# Vivado block design msys, xc7a100tfgg484-2, Vivado 2020.2.2
# (continued, part 2 of 3)
current_bd_instance /SCOPE

# ---- hierarchy /CFG_Si5338 ----
current_bd_instance /CFG_Si5338
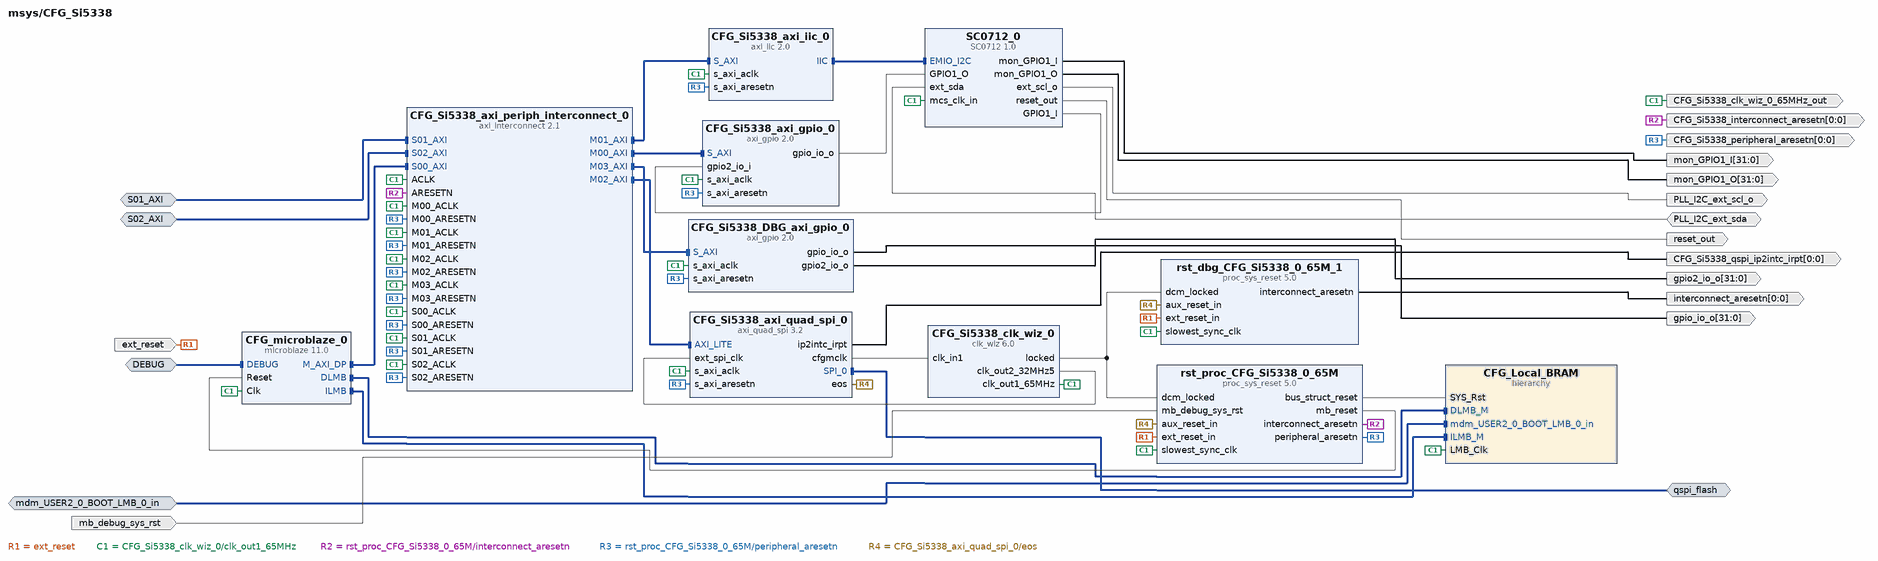
[diagram p17: block diagram inside /CFG_Si5338]
create_bd_intf_pin -mode Master -vlnv xilinx.com:interface:spi_rtl:1.0 qspi_flash
create_bd_intf_pin -mode Slave -vlnv xilinx.com:interface:aximm_rtl:1.0 S02_AXI
create_bd_intf_pin -mode Slave -vlnv xilinx.com:interface:lmb_rtl:1.0 mdm_USER2_0_BOOT_LMB_0_in
create_bd_intf_pin -mode Slave -vlnv xilinx.com:interface:aximm_rtl:1.0 S01_AXI
create_bd_intf_pin -mode Slave -vlnv xilinx.com:interface:mbdebug_rtl:3.0 DEBUG
create_bd_pin -dir O -from 0 -to 0 -type intr CFG_Si5338_qspi_ip2intc_irpt
create_bd_pin -dir O -from 31 -to 0 mon_GPIO1_I
create_bd_pin -dir O -from 31 -to 0 mon_GPIO1_O
create_bd_pin -dir O PLL_I2C_ext_scl_o
create_bd_pin -dir IO PLL_I2C_ext_sda
create_bd_pin -dir O -type rst reset_out
create_bd_pin -dir I -type rst ext_reset
create_bd_pin -dir O -from 0 -to 0 -type rst CFG_Si5338_interconnect_aresetn
create_bd_pin -dir I -type rst mb_debug_sys_rst
create_bd_pin -dir O -from 0 -to 0 -type rst CFG_Si5338_peripheral_aresetn
create_bd_pin -dir O -type clk CFG_Si5338_clk_wiz_0_65MHz_out
create_bd_pin -dir O -from 0 -to 0 -type rst interconnect_aresetn
create_bd_pin -dir O -from 31 -to 0 gpio_io_o
create_bd_pin -dir O -from 31 -to 0 gpio2_io_o

create_bd_cell -type ip -vlnv trenz.biz:user:SC0712:1.0 SC0712_0
create_bd_cell -type ip -vlnv xilinx.com:ip:proc_sys_reset:5.0 rst_proc_CFG_Si5338_0_65M
set_property -dict [list \
  CONFIG.C_AUX_RESET_HIGH 0 \
  CONFIG.C_NUM_PERP_RST 1 \
  CONFIG.RESET_BOARD_INTERFACE reset \
  CONFIG.USE_BOARD_FLOW true \
] [get_bd_cells rst_proc_CFG_Si5338_0_65M]
create_bd_cell -type hier CFG_Local_BRAM
create_bd_cell -type ip -vlnv xilinx.com:ip:proc_sys_reset:5.0 rst_dbg_CFG_Si5338_0_65M_1
set_property -dict [list \
  CONFIG.C_AUX_RESET_HIGH 0 \
  CONFIG.C_NUM_PERP_RST 1 \
  CONFIG.RESET_BOARD_INTERFACE reset \
  CONFIG.USE_BOARD_FLOW true \
] [get_bd_cells rst_dbg_CFG_Si5338_0_65M_1]
create_bd_cell -type ip -vlnv xilinx.com:ip:axi_gpio:2.0 CFG_Si5338_DBG_axi_gpio_0
set_property -dict [list \
  CONFIG.C_ALL_INPUTS 0 \
  CONFIG.C_ALL_INPUTS_2 0 \
  CONFIG.C_ALL_OUTPUTS 1 \
  CONFIG.C_ALL_OUTPUTS_2 1 \
  CONFIG.C_DOUT_DEFAULT 0x00000003 \
  CONFIG.C_IS_DUAL 1 \
] [get_bd_cells CFG_Si5338_DBG_axi_gpio_0]
create_bd_cell -type ip -vlnv xilinx.com:ip:axi_gpio:2.0 CFG_Si5338_axi_gpio_0
set_property -dict [list \
  CONFIG.C_ALL_INPUTS_2 1 \
  CONFIG.C_ALL_OUTPUTS 1 \
  CONFIG.C_DOUT_DEFAULT 0x00000003 \
  CONFIG.C_IS_DUAL 1 \
] [get_bd_cells CFG_Si5338_axi_gpio_0]
create_bd_cell -type ip -vlnv xilinx.com:ip:axi_iic:2.0 CFG_Si5338_axi_iic_0
set_property -dict {CONFIG.IIC_FREQ_KHZ 100} [get_bd_cells CFG_Si5338_axi_iic_0]
create_bd_cell -type ip -vlnv xilinx.com:ip:axi_interconnect:2.1 CFG_Si5338_axi_periph_interconnect_0
set_property -dict {CONFIG.NUM_MI 4 CONFIG.NUM_SI 3} [get_bd_cells CFG_Si5338_axi_periph_interconnect_0]
create_bd_cell -type ip -vlnv xilinx.com:ip:axi_quad_spi:3.2 CFG_Si5338_axi_quad_spi_0
set_property -dict [list \
  CONFIG.C_FIFO_DEPTH 256 \
  CONFIG.C_SPI_MEMORY 3 \
  CONFIG.C_SPI_MODE 2 \
  CONFIG.C_S_AXI4_ID_WIDTH 0 \
  CONFIG.QSPI_BOARD_INTERFACE qspi_flash \
  CONFIG.USE_BOARD_FLOW true \
] [get_bd_cells CFG_Si5338_axi_quad_spi_0]
create_bd_cell -type ip -vlnv xilinx.com:ip:clk_wiz:6.0 CFG_Si5338_clk_wiz_0
set_property -dict [list \
  CONFIG.CLKIN1_JITTER_PS 153.84 \
  CONFIG.CLKIN2_JITTER_PS 162.49 \
  CONFIG.CLKOUT1_DRIVES BUFGCE \
  CONFIG.CLKOUT1_JITTER 181.383 \
  CONFIG.CLKOUT1_PHASE_ERROR 117.736 \
  CONFIG.CLKOUT1_REQUESTED_OUT_FREQ 65 \
  CONFIG.CLKOUT2_DRIVES BUFGCE \
  CONFIG.CLKOUT2_JITTER 210.870 \
  CONFIG.CLKOUT2_PHASE_ERROR 117.736 \
  CONFIG.CLKOUT2_REQUESTED_OUT_FREQ 32.5 \
  CONFIG.CLKOUT2_USED true \
  CONFIG.CLKOUT3_DRIVES BUFGCE \
  CONFIG.CLKOUT4_DRIVES BUFGCE \
  CONFIG.CLKOUT5_DRIVES BUFGCE \
  CONFIG.CLKOUT6_DRIVES BUFGCE \
  CONFIG.CLKOUT7_DRIVES BUFGCE \
  CONFIG.CLK_OUT1_PORT clk_out1_65MHz \
  CONFIG.CLK_OUT2_PORT clk_out2_32MHz5 \
  CONFIG.FEEDBACK_SOURCE FDBK_AUTO \
  CONFIG.JITTER_SEL No_Jitter \
  CONFIG.MMCM_BANDWIDTH OPTIMIZED \
  CONFIG.MMCM_CLKFBOUT_MULT_F 13 \
  CONFIG.MMCM_CLKIN1_PERIOD 15.385 \
  CONFIG.MMCM_CLKIN2_PERIOD 10.000 \
  CONFIG.MMCM_CLKOUT0_DIVIDE_F 13 \
  CONFIG.MMCM_CLKOUT0_DUTY_CYCLE 0.5 \
  CONFIG.MMCM_CLKOUT1_DIVIDE 26 \
  CONFIG.MMCM_CLKOUT1_DUTY_CYCLE 0.5 \
  CONFIG.MMCM_COMPENSATION ZHOLD \
  CONFIG.NUM_OUT_CLKS 2 \
  CONFIG.PLL_CLKIN_PERIOD 15.384 \
  CONFIG.PRIMITIVE PLL \
  CONFIG.PRIM_IN_FREQ 65 \
  CONFIG.PRIM_SOURCE Global_buffer \
  CONFIG.RESET_PORT reset \
  CONFIG.RESET_TYPE ACTIVE_HIGH \
  CONFIG.SECONDARY_IN_FREQ 100.000 \
  CONFIG.SECONDARY_SOURCE Single_ended_clock_capable_pin \
  CONFIG.USE_INCLK_SWITCHOVER false \
  CONFIG.USE_MIN_POWER true \
  CONFIG.USE_RESET false \
  CONFIG.USE_SAFE_CLOCK_STARTUP true \
] [get_bd_cells CFG_Si5338_clk_wiz_0]
create_bd_cell -type ip -vlnv xilinx.com:ip:microblaze:11.0 CFG_microblaze_0
set_property -dict [list \
  CONFIG.C_ADDR_TAG_BITS 0 \
  CONFIG.C_AREA_OPTIMIZED 1 \
  CONFIG.C_DCACHE_ADDR_TAG 0 \
  CONFIG.C_DEBUG_ENABLED 2 \
  CONFIG.C_D_AXI 1 \
  CONFIG.C_D_LMB 1 \
  CONFIG.C_I_AXI 0 \
  CONFIG.C_I_LMB 1 \
  CONFIG.C_NUMBER_OF_PC_BRK 5 \
  CONFIG.C_NUMBER_OF_RD_ADDR_BRK 1 \
  CONFIG.C_NUMBER_OF_WR_ADDR_BRK 1 \
  CONFIG.C_USE_DCACHE 0 \
  CONFIG.C_USE_ICACHE 0 \
  CONFIG.C_USE_REORDER_INSTR 0 \
  CONFIG.G_TEMPLATE_LIST 1 \
] [get_bd_cells CFG_microblaze_0]

# ---- hierarchy /CFG_Si5338/CFG_Local_BRAM ----
current_bd_instance /CFG_Si5338/CFG_Local_BRAM
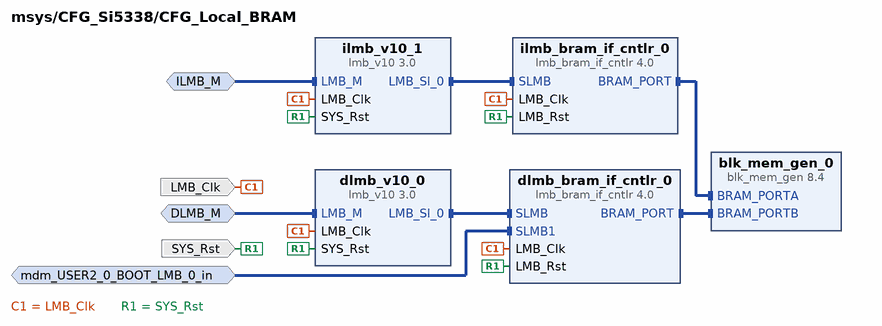
[diagram p18: block diagram inside /CFG_Si5338/CFG_Local_BRAM]
create_bd_intf_pin -mode MirroredMaster -vlnv xilinx.com:interface:lmb_rtl:1.0 ILMB_M
create_bd_intf_pin -mode MirroredMaster -vlnv xilinx.com:interface:lmb_rtl:1.0 DLMB_M
create_bd_intf_pin -mode Slave -vlnv xilinx.com:interface:lmb_rtl:1.0 mdm_USER2_0_BOOT_LMB_0_in
create_bd_pin -dir I -type clk LMB_Clk
create_bd_pin -dir I -type rst SYS_Rst

create_bd_cell -type ip -vlnv xilinx.com:ip:lmb_v10:3.0 dlmb_v10_0
create_bd_cell -type ip -vlnv xilinx.com:ip:lmb_v10:3.0 ilmb_v10_1
create_bd_cell -type ip -vlnv xilinx.com:ip:blk_mem_gen:8.4 blk_mem_gen_0
set_property -dict [list \
  CONFIG.Assume_Synchronous_Clk true \
  CONFIG.Enable_B Use_ENB_Pin \
  CONFIG.Memory_Type True_Dual_Port_RAM \
  CONFIG.Port_B_Clock 100 \
  CONFIG.Port_B_Enable_Rate 100 \
  CONFIG.Port_B_Write_Rate 50 \
  CONFIG.Use_RSTB_Pin true \
] [get_bd_cells blk_mem_gen_0]
create_bd_cell -type ip -vlnv xilinx.com:ip:lmb_bram_if_cntlr:4.0 ilmb_bram_if_cntlr_0
set_property -dict {CONFIG.C_NUM_LMB 1} [get_bd_cells ilmb_bram_if_cntlr_0]
create_bd_cell -type ip -vlnv xilinx.com:ip:lmb_bram_if_cntlr:4.0 dlmb_bram_if_cntlr_0
set_property -dict {CONFIG.C_NUM_LMB 2} [get_bd_cells dlmb_bram_if_cntlr_0]

# ---- hierarchy /CLOCK ----
current_bd_instance /CLOCK
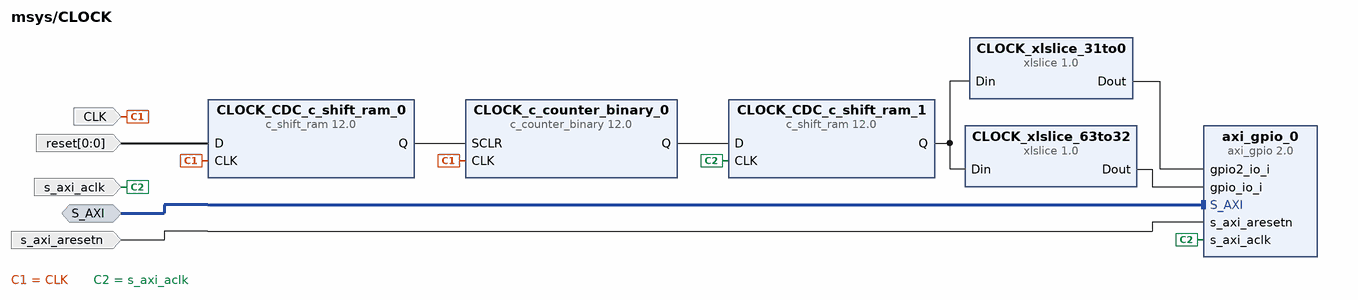
[diagram p19: block diagram inside /CLOCK]
create_bd_intf_pin -mode Slave -vlnv xilinx.com:interface:aximm_rtl:1.0 S_AXI
create_bd_pin -dir I -type clk CLK
create_bd_pin -dir I -from 0 -to 0 -type data reset
create_bd_pin -dir I -type clk s_axi_aclk
create_bd_pin -dir I -type rst s_axi_aresetn

create_bd_cell -type ip -vlnv xilinx.com:ip:c_counter_binary:12.0 CLOCK_c_counter_binary_0
set_property -dict {CONFIG.Output_Width 64 CONFIG.SCLR true} [get_bd_cells CLOCK_c_counter_binary_0]
create_bd_cell -type ip -vlnv xilinx.com:ip:c_shift_ram:12.0 CLOCK_CDC_c_shift_ram_0
set_property -dict [list \
  CONFIG.AsyncInitVal 0 \
  CONFIG.DefaultData 0 \
  CONFIG.Depth 2 \
  CONFIG.Width 1 \
] [get_bd_cells CLOCK_CDC_c_shift_ram_0]
create_bd_cell -type ip -vlnv xilinx.com:ip:c_shift_ram:12.0 CLOCK_CDC_c_shift_ram_1
set_property -dict [list \
  CONFIG.AsyncInitVal 0000000000000000000000000000000000000000000000000000000000000000 \
  CONFIG.DefaultData 0000000000000000000000000000000000000000000000000000000000000000 \
  CONFIG.Depth 2 \
  CONFIG.Width 64 \
] [get_bd_cells CLOCK_CDC_c_shift_ram_1]
create_bd_cell -type ip -vlnv xilinx.com:ip:xlslice:1.0 CLOCK_xlslice_31to0
set_property -dict {CONFIG.DIN_FROM 31 CONFIG.DIN_WIDTH 64 CONFIG.DOUT_WIDTH 32} [get_bd_cells CLOCK_xlslice_31to0]
create_bd_cell -type ip -vlnv xilinx.com:ip:xlslice:1.0 CLOCK_xlslice_63to32
set_property -dict [list \
  CONFIG.DIN_FROM 63 \
  CONFIG.DIN_TO 32 \
  CONFIG.DIN_WIDTH 64 \
  CONFIG.DOUT_WIDTH 32 \
] [get_bd_cells CLOCK_xlslice_63to32]
create_bd_cell -type ip -vlnv xilinx.com:ip:axi_gpio:2.0 axi_gpio_0
set_property -dict {CONFIG.C_ALL_INPUTS 1 CONFIG.C_ALL_INPUTS_2 1 CONFIG.C_IS_DUAL 1} [get_bd_cells axi_gpio_0]

# ---- hierarchy /AXI_TRX ----
current_bd_instance /AXI_TRX
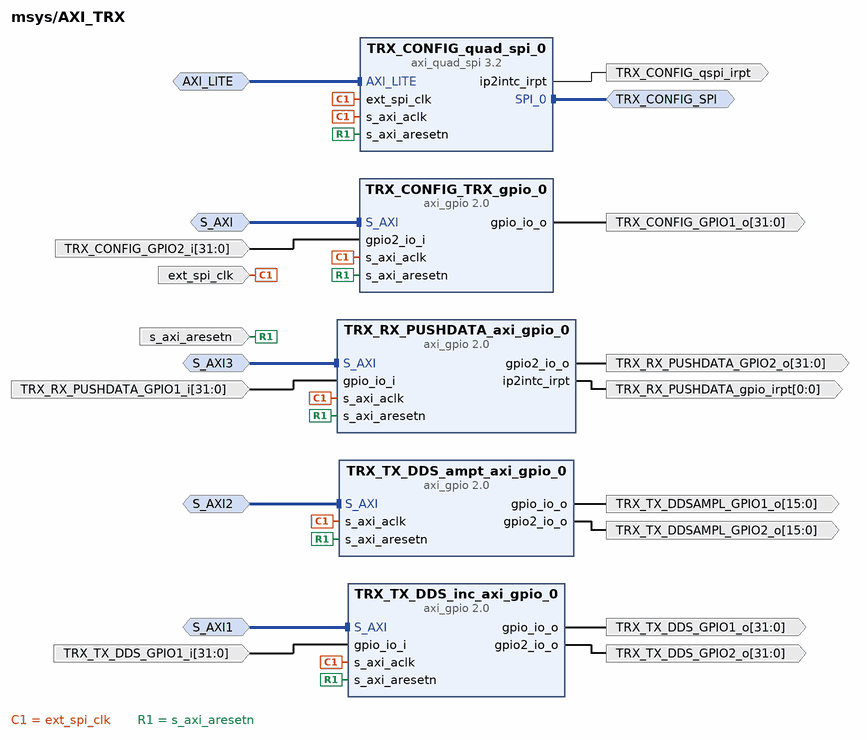
[diagram p20: block diagram inside /AXI_TRX]
create_bd_intf_pin -mode Slave -vlnv xilinx.com:interface:aximm_rtl:1.0 AXI_LITE
create_bd_intf_pin -mode Master -vlnv xilinx.com:interface:spi_rtl:1.0 TRX_CONFIG_SPI
create_bd_intf_pin -mode Slave -vlnv xilinx.com:interface:aximm_rtl:1.0 S_AXI
create_bd_intf_pin -mode Slave -vlnv xilinx.com:interface:aximm_rtl:1.0 S_AXI1
create_bd_intf_pin -mode Slave -vlnv xilinx.com:interface:aximm_rtl:1.0 S_AXI2
create_bd_intf_pin -mode Slave -vlnv xilinx.com:interface:aximm_rtl:1.0 S_AXI3
create_bd_pin -dir I -type clk ext_spi_clk
create_bd_pin -dir I -type rst s_axi_aresetn
create_bd_pin -dir O -type intr TRX_CONFIG_qspi_irpt
create_bd_pin -dir O -from 31 -to 0 TRX_CONFIG_GPIO1_o
create_bd_pin -dir I -from 31 -to 0 TRX_CONFIG_GPIO2_i
create_bd_pin -dir O -from 31 -to 0 TRX_TX_DDS_GPIO1_o
create_bd_pin -dir I -from 31 -to 0 TRX_TX_DDS_GPIO1_i
create_bd_pin -dir O -from 31 -to 0 TRX_TX_DDS_GPIO2_o
create_bd_pin -dir O -from 15 -to 0 TRX_TX_DDSAMPL_GPIO1_o
create_bd_pin -dir O -from 15 -to 0 TRX_TX_DDSAMPL_GPIO2_o
create_bd_pin -dir O -from 0 -to 0 -type intr TRX_RX_PUSHDATA_gpio_irpt
create_bd_pin -dir I -from 31 -to 0 TRX_RX_PUSHDATA_GPIO1_i
create_bd_pin -dir O -from 31 -to 0 TRX_RX_PUSHDATA_GPIO2_o

create_bd_cell -type ip -vlnv xilinx.com:ip:axi_quad_spi:3.2 TRX_CONFIG_quad_spi_0
set_property -dict [list \
  CONFIG.C_FIFO_DEPTH 256 \
  CONFIG.C_NUM_SS_BITS 1 \
  CONFIG.C_SCK_RATIO 16 \
  CONFIG.C_S_AXI4_ID_WIDTH 0 \
  CONFIG.C_USE_STARTUP 0 \
  CONFIG.FIFO_INCLUDED 1 \
] [get_bd_cells TRX_CONFIG_quad_spi_0]
create_bd_cell -type ip -vlnv xilinx.com:ip:axi_gpio:2.0 TRX_TX_DDS_ampt_axi_gpio_0
set_property -dict [list \
  CONFIG.C_ALL_OUTPUTS 1 \
  CONFIG.C_ALL_OUTPUTS_2 1 \
  CONFIG.C_GPIO2_WIDTH 16 \
  CONFIG.C_GPIO_WIDTH 16 \
  CONFIG.C_IS_DUAL 1 \
] [get_bd_cells TRX_TX_DDS_ampt_axi_gpio_0]
create_bd_cell -type ip -vlnv xilinx.com:ip:axi_gpio:2.0 TRX_TX_DDS_inc_axi_gpio_0
set_property -dict [list \
  CONFIG.C_ALL_OUTPUTS 0 \
  CONFIG.C_ALL_OUTPUTS_2 1 \
  CONFIG.C_GPIO2_WIDTH 32 \
  CONFIG.C_GPIO_WIDTH 32 \
  CONFIG.C_IS_DUAL 1 \
  CONFIG.C_TRI_DEFAULT 0x80000000 \
] [get_bd_cells TRX_TX_DDS_inc_axi_gpio_0]
create_bd_cell -type ip -vlnv xilinx.com:ip:axi_gpio:2.0 TRX_CONFIG_TRX_gpio_0
set_property -dict [list \
  CONFIG.C_ALL_INPUTS 0 \
  CONFIG.C_ALL_INPUTS_2 1 \
  CONFIG.C_ALL_OUTPUTS 1 \
  CONFIG.C_DOUT_DEFAULT 0x00000000 \
  CONFIG.C_GPIO2_WIDTH 32 \
  CONFIG.C_GPIO_WIDTH 32 \
  CONFIG.C_INTERRUPT_PRESENT 0 \
  CONFIG.C_IS_DUAL 1 \
] [get_bd_cells TRX_CONFIG_TRX_gpio_0]
create_bd_cell -type ip -vlnv xilinx.com:ip:axi_gpio:2.0 TRX_RX_PUSHDATA_axi_gpio_0
set_property -dict [list \
  CONFIG.C_ALL_INPUTS 1 \
  CONFIG.C_ALL_OUTPUTS_2 1 \
  CONFIG.C_DOUT_DEFAULT_2 0x00000400 \
  CONFIG.C_GPIO2_WIDTH 32 \
  CONFIG.C_GPIO_WIDTH 32 \
  CONFIG.C_INTERRUPT_PRESENT 1 \
  CONFIG.C_IS_DUAL 1 \
] [get_bd_cells TRX_RX_PUSHDATA_axi_gpio_0]

# ---- connections ----

current_bd_instance /microblaze_0_local_memory
connect_bd_intf_net [get_bd_intf_pins ilmb_bram_if_cntlr/BRAM_PORT] [get_bd_intf_pins lmb_bram/BRAM_PORTA]
connect_bd_intf_net [get_bd_intf_pins axi_bram_ctrl_0/BRAM_PORTA] [get_bd_intf_pins lmb_bram/BRAM_PORTB]
connect_bd_intf_net [get_bd_intf_pins DLMB] [get_bd_intf_pins dlmb_v10/LMB_M]
connect_bd_intf_net [get_bd_intf_pins ILMB] [get_bd_intf_pins ilmb_v10/LMB_M]
connect_bd_intf_net [get_bd_intf_pins dlmb_v10/LMB_Sl_0] [get_bd_intf_pins ilmb_bram_if_cntlr/SLMB1]
connect_bd_intf_net [get_bd_intf_pins mdm_USER2_0_microblaze_LMB_1_in] [get_bd_intf_pins ilmb_bram_if_cntlr/SLMB2]
connect_bd_intf_net [get_bd_intf_pins S_AXI] [get_bd_intf_pins axi_bram_ctrl_0/S_AXI]
connect_bd_intf_net [get_bd_intf_pins ilmb_bram_if_cntlr/SLMB] [get_bd_intf_pins ilmb_v10/LMB_Sl_0]
connect_bd_net [get_bd_pins SYS_Rst] [get_bd_pins dlmb_v10/SYS_Rst] [get_bd_pins ilmb_v10/SYS_Rst] [get_bd_pins ilmb_bram_if_cntlr/LMB_Rst]
connect_bd_net -net microblaze_0_Clk [get_bd_pins LMB_Clk] \
  [get_bd_pins dlmb_v10/LMB_Clk] [get_bd_pins ilmb_v10/LMB_Clk] [get_bd_pins axi_bram_ctrl_0/s_axi_aclk] \
  [get_bd_pins ilmb_bram_if_cntlr/LMB_Clk]
connect_bd_net [get_bd_pins s_axi_aresetn] [get_bd_pins axi_bram_ctrl_0/s_axi_aresetn]
set_property HDL_ATTRIBUTE.BMM_INFO_ADDRESS_SPACE {byte  0x00010000 32 > msys microblaze_0_local_memory/lmb_bram} [get_bd_cells ilmb_bram_if_cntlr]
set_property HDL_ATTRIBUTE.KEEP_HIERARCHY yes [get_bd_cells ilmb_bram_if_cntlr]

current_bd_instance /UART0
connect_bd_intf_net [get_bd_intf_pins UART0] [get_bd_intf_pins axi_UART0_uartlite_0/UART]
connect_bd_intf_net [get_bd_intf_pins S_AXI] [get_bd_intf_pins axi_UART0_gpio_0/S_AXI]
connect_bd_intf_net [get_bd_intf_pins S_AXI1] [get_bd_intf_pins axi_UART0_uartlite_0/S_AXI]
connect_bd_net -net Din_1 [get_bd_pins axi_UART0_gpio_0/gpio_io_o] \
  [get_bd_pins UART0_xlslice_0/Din] [get_bd_pins UART0_xlslice_1/Din] [get_bd_pins UART0_xlslice_2/Din] \
  [get_bd_pins UART0_xlslice_3/Din]
connect_bd_net [get_bd_pins UART0_xlslice_0/Dout] [get_bd_pins UART0EXT_CTSn]
connect_bd_net [get_bd_pins UART0_xlslice_1/Dout] [get_bd_pins UART0EXT_DSRn]
connect_bd_net [get_bd_pins UART0_xlslice_2/Dout] [get_bd_pins UART0EXT_DCDn]
connect_bd_net [get_bd_pins UART0_xlslice_3/Dout] [get_bd_pins UART0EXT_RIn]
connect_bd_net [get_bd_pins axi_UART0_gpio_0/ip2intc_irpt] [get_bd_pins ip2intc_irpt]
connect_bd_net [get_bd_pins s_axi_aclk] [get_bd_pins axi_UART0_gpio_0/s_axi_aclk] [get_bd_pins axi_UART0_uartlite_0/s_axi_aclk]
connect_bd_net [get_bd_pins s_axi_aresetn] [get_bd_pins axi_UART0_gpio_0/s_axi_aresetn] [get_bd_pins axi_UART0_uartlite_0/s_axi_aresetn]
connect_bd_net [get_bd_pins UART0_xlconcat_1/dout] [get_bd_pins axi_UART0_gpio_0/gpio2_io_i]
connect_bd_net [get_bd_pins UART0EXT_RTSn] [get_bd_pins UART0_xlconcat_1/In0]
connect_bd_net [get_bd_pins UART0EXT_DTRn] [get_bd_pins UART0_xlconcat_1/In1]
connect_bd_net [get_bd_pins ext_reset_in] [get_bd_pins rst_mig_7series_0_12M/ext_reset_in]
connect_bd_net [get_bd_pins slowest_sync_clk] [get_bd_pins rst_mig_7series_0_12M/slowest_sync_clk]
connect_bd_net [get_bd_pins rst_mig_7series_0_12M/peripheral_aresetn] [get_bd_pins UART0_rst_n]
connect_bd_net [get_bd_pins axi_UART0_uartlite_0/interrupt] [get_bd_pins interrupt]

current_bd_instance /PWM_lights
connect_bd_intf_net [get_bd_intf_pins S_AXI] [get_bd_intf_pins axi_PWM_gpio_0/S_AXI]
connect_bd_net [get_bd_pins axi_PWM_gpio_0/ip2intc_irpt] [get_bd_pins ip2intc_irpt]
connect_bd_net [get_bd_pins s_axi_aclk] \
  [get_bd_pins PWM_counter_binary_0/CLK] [get_bd_pins RGB_blue_compare_0/CLK] [get_bd_pins RGB_green_compare_0/CLK] \
  [get_bd_pins LCD_BL_compare_0/CLK] [get_bd_pins RGB_red_compare_0/CLK] [get_bd_pins axi_PWM_gpio_0/s_axi_aclk]
connect_bd_net [get_bd_pins s_axi_aresetn] [get_bd_pins axi_PWM_gpio_0/s_axi_aresetn]
connect_bd_net [get_bd_pins axi_PWM_gpio_0/gpio_io_o] \
  [get_bd_pins PWM_gpio_xlslice_7to0_0/Din] [get_bd_pins PWM_gpio_xlslice_31to24_0/Din] \
  [get_bd_pins PWM_gpio_xlslice_15to8_0/Din] [get_bd_pins PWM_gpio_xlslice_23to16_0/Din]
connect_bd_net [get_bd_pins PWM_counter_binary_0/Q] [get_bd_pins PWM_ctr_xlslice_17to10_0/Din]
connect_bd_net -net PWM_ctr_xlslice_0_Dout [get_bd_pins PWM_ctr_xlslice_17to10_0/Dout] \
  [get_bd_pins RGB_blue_compare_0/A] [get_bd_pins RGB_green_compare_0/A] [get_bd_pins LCD_BL_compare_0/A] \
  [get_bd_pins RGB_red_compare_0/A]
connect_bd_net -net PWM_gpio_xlslice_21to16_0_Dout [get_bd_pins PWM_gpio_xlslice_23to16_0/Dout] [get_bd_pins RGB_blue_compare_0/B]
connect_bd_net [get_bd_pins PWM_gpio_xlslice_15to8_0/Dout] [get_bd_pins RGB_green_compare_0/B]
connect_bd_net [get_bd_pins PWM_gpio_xlslice_31to24_0/Dout] [get_bd_pins LCD_BL_compare_0/B]
connect_bd_net [get_bd_pins PWM_gpio_xlslice_7to0_0/Dout] [get_bd_pins RGB_red_compare_0/B]
connect_bd_net -net PWM_GPIO_xlslice_1_Dout [get_bd_pins PWM_GPIO_xlslice_0to0_0/Dout] [get_bd_pins LCD_rstn]
connect_bd_net [get_bd_pins RGB_blue_compare_0/S] [get_bd_pins RGB_blue_xlslice_8to8_0/Din]
connect_bd_net -net RGB_blue_xlslice_0_Dout [get_bd_pins RGB_blue_xlslice_8to8_0/Dout] [get_bd_pins LED_RGB_blue]
connect_bd_net [get_bd_pins RGB_green_compare_0/S] [get_bd_pins RGB_green_xlslice_8to8_0/Din]
connect_bd_net -net RGB_green_xlslice_0_Dout [get_bd_pins RGB_green_xlslice_8to8_0/Dout] [get_bd_pins LED_RGB_green]
connect_bd_net -net LCD_BL_xlslice_0_Dout [get_bd_pins LCD_BL_xlslice_8to8_0/Dout] [get_bd_pins LCD_BL]
connect_bd_net [get_bd_pins LCD_BL_compare_0/S] [get_bd_pins LCD_BL_xlslice_8to8_0/Din]
connect_bd_net [get_bd_pins RGB_red_compare_0/S] [get_bd_pins RGB_red_xlslice_8to8_0/Din]
connect_bd_net [get_bd_pins PWM_GPIO2_xlconcat_0/dout] [get_bd_pins axi_PWM_gpio_0/gpio2_io_i]
connect_bd_net [get_bd_pins axi_PWM_gpio_0/gpio2_io_o] [get_bd_pins PWM_GPIO_xlslice_0to0_0/Din] [get_bd_pins PWM_GPIO2_xlslice_15to0_0/Din]
connect_bd_net [get_bd_pins PWM_GPIO2_xlslice_15to0_0/Dout] [get_bd_pins PWM_GPIO2_xlconcat_0/In0]
connect_bd_net -net xlconstant_0_len15_dout [get_bd_pins xlconstant_0_len16/dout] [get_bd_pins PWM_GPIO2_xlconcat_0/In1]
connect_bd_net [get_bd_pins RGB_red_xlslice_8to8_0/Dout] [get_bd_pins LED_RGB_red]

current_bd_instance /ROTENC_decoder
connect_bd_intf_net [get_bd_intf_pins S_AXI] [get_bd_intf_pins axi_ROTENC_gpio_0/S_AXI]
connect_bd_net [get_bd_pins CLK] [get_bd_pins axi_ROTENC_gpio_0/s_axi_aclk] [get_bd_pins rotenc_decoder_0/clk]
connect_bd_net [get_bd_pins axi_ROTENC_gpio_0/ip2intc_irpt] [get_bd_pins ip2intc_irpt]
connect_bd_net [get_bd_pins s_axi_aresetn] [get_bd_pins axi_ROTENC_gpio_0/s_axi_aresetn] [get_bd_pins rotenc_decoder_0/resetn]
connect_bd_net -net BOARD_ROTENC_PUSH_0 [get_bd_pins BOARD_ROTENC_PUSH_in] [get_bd_pins axi_ROTENC_gpio_0/gpio2_io_i]
connect_bd_net -net ROTENC_counter_32bit_0_Q [get_bd_pins rotenc_decoder_0/cntval] [get_bd_pins Q] [get_bd_pins axi_ROTENC_gpio_0/gpio_io_i]
connect_bd_net -net BOARD_ROTENC_I_01 [get_bd_pins BOARD_ROTENC_I_in] [get_bd_pins rotenc_decoder_0/rotenc_I]
connect_bd_net -net rotenc_Q_0_1 [get_bd_pins BOARD_ROTENC_Q_in] [get_bd_pins rotenc_decoder_0/rotenc_Q]

current_bd_instance /ETH0
connect_bd_intf_net [get_bd_intf_pins S_AXI] [get_bd_intf_pins ETH0_axi_ethernetlite_0/S_AXI]
connect_bd_intf_net [get_bd_intf_pins RMII_PHY_M_0] [get_bd_intf_pins ETH0_mii_to_rmii_0/RMII_PHY_M]
connect_bd_intf_net [get_bd_intf_pins ETH0_MDIO_MDC] [get_bd_intf_pins ETH0_axi_ethernetlite_0/MDIO]
connect_bd_net [get_bd_pins ETH0_LEDs/ETH0_DA_G] [get_bd_pins ETH0_DA_G_out]
connect_bd_net -net rst_n_0 [get_bd_pins ETH0_LEDs_proc_sys_reset_0/peripheral_aresetn] [get_bd_pins ETH0_mii_to_rmii_0/rst_n]
connect_bd_net -net CLK1B_50MHz_phy_clk_0 [get_bd_pins CLK1B_50MHz_phy_clk_in] \
  [get_bd_pins ETH0_mii_to_rmii_0/ref_clk] [get_bd_pins ETH0_LEDs_proc_sys_reset_0/slowest_sync_clk]
connect_bd_net -net mii_y_adapater_0_s_mii_rx_dv [get_bd_pins ETH0_mii_to_rmii_0/rmii2mac_rx_dv] \
  [get_bd_pins s_mii_rx_dv_out] [get_bd_pins ETH0_axi_ethernetlite_0/phy_dv] [get_bd_pins ETH0_MIIstatus_xlconcat_0/In0] \
  [get_bd_pins ETH0_LEDs_xlconcat_0/In1]
connect_bd_net -net axi_ethernetlite_0_phy_tx_en [get_bd_pins ETH0_axi_ethernetlite_0/phy_tx_en] \
  [get_bd_pins m_mii_tx_en_out] [get_bd_pins ETH0_mii_to_rmii_0/mac2rmii_tx_en] [get_bd_pins ETH0_LEDs/m_mii_tx_en] \
  [get_bd_pins ETH0_LEDs_xlconcat_0/In2]
connect_bd_net [get_bd_pins ext_reset_in] [get_bd_pins ETH0_LEDs_proc_sys_reset_0/ext_reset_in]
connect_bd_net -net dcm_locked_1 [get_bd_pins dcm_locked_in] [get_bd_pins ETH0_LEDs_proc_sys_reset_0/dcm_locked]
connect_bd_net -net ETH0_LINK_LED_inv_0 [get_bd_pins ETH0_util_vector_logic_0/Res] \
  [get_bd_pins ETH0_LEDs/ETH0_LINK_LED_inv] [get_bd_pins ETH0_LEDs_xlconcat_0/In0]
connect_bd_net -net ETH0_LINK_LED_0 [get_bd_pins ETH0_LINK_LED_in] [get_bd_pins ETH0_util_vector_logic_0/Op1]
connect_bd_net -net CFG_Si5338_pll_65MHz_0 [get_bd_pins CFG_Si5338_pll_65MHz_in] \
  [get_bd_pins ETH0_LEDstatus_CDC_c_shift_ram_0/CLK] [get_bd_pins ETH0_txd_CDC_c_shift_ram_0/CLK] \
  [get_bd_pins ETH0_rxd_CDC_c_shift_ram_0/CLK] [get_bd_pins ETH0_MIIstatus_CDC_c_shift_ram_0/CLK]
connect_bd_net -net mii_y_adapater_0_s_mii_tx_clk [get_bd_pins ETH0_mii_to_rmii_0/rmii2mac_tx_clk] \
  [get_bd_pins s_mii_tx_clk_out] [get_bd_pins ETH0_axi_ethernetlite_0/phy_tx_clk]
connect_bd_net -net mii_y_adapater_0_s_mii_rx_clk [get_bd_pins ETH0_mii_to_rmii_0/rmii2mac_rx_clk] \
  [get_bd_pins s_mii_rx_clk_out] [get_bd_pins ETH0_axi_ethernetlite_0/phy_rx_clk]
connect_bd_net [get_bd_pins ETH0_LEDs/ETH0_DA_Y] [get_bd_pins ETH0_DA_Y_out]
connect_bd_net [get_bd_pins ETH0_LEDs_xlconcat_0/dout] [get_bd_pins ETH0_LEDstatus_CDC_c_shift_ram_0/D]
connect_bd_net [get_bd_pins ETH0_LEDstatus_CDC_c_shift_ram_0/Q] [get_bd_pins ETH0_status_vio_out]
connect_bd_net -net ETH0_mii_y_adapater_0_m_mii_txd [get_bd_pins ETH0_axi_ethernetlite_0/phy_tx_data] \
  [get_bd_pins ETH0_txd_CDC_c_shift_ram_0/D] [get_bd_pins m_mii_txd1_out] [get_bd_pins ETH0_mii_to_rmii_0/mac2rmii_txd]
connect_bd_net -net ETH0_mii_y_adapater_0_s_mii_rxd [get_bd_pins ETH0_mii_to_rmii_0/rmii2mac_rxd] \
  [get_bd_pins ETH0_rxd_CDC_c_shift_ram_0/D] [get_bd_pins s_mii_rxd1_out] [get_bd_pins ETH0_axi_ethernetlite_0/phy_rx_data]
connect_bd_net -net ETH0_mii_y_adapater_0_m_mii_tx_er [get_bd_pins ETH0_xlconstant_val0_len1/dout] \
  [get_bd_pins m_mii_tx_er_out] [get_bd_pins ETH0_mii_to_rmii_0/mac2rmii_tx_er] [get_bd_pins ETH0_MIIstatus_xlconcat_0/In4]
connect_bd_net -net ETH0_mii_y_adapater_0_s_mii_rx_er [get_bd_pins ETH0_mii_to_rmii_0/rmii2mac_rx_er] \
  [get_bd_pins s_mii_rx_er_out] [get_bd_pins ETH0_axi_ethernetlite_0/phy_rx_er] [get_bd_pins ETH0_MIIstatus_xlconcat_0/In3]
connect_bd_net -net ETH0_mii_y_adapater_0_s_mii_crs [get_bd_pins ETH0_mii_to_rmii_0/rmii2mac_crs] \
  [get_bd_pins s_mii_crs_out] [get_bd_pins ETH0_LEDs/s_mii_crs] [get_bd_pins ETH0_axi_ethernetlite_0/phy_crs] \
  [get_bd_pins ETH0_MIIstatus_xlconcat_0/In1]
connect_bd_net -net ETH0_mii_y_adapater_0_s_mii_col [get_bd_pins ETH0_mii_to_rmii_0/rmii2mac_col] \
  [get_bd_pins s_mii_col_out] [get_bd_pins ETH0_axi_ethernetlite_0/phy_col] [get_bd_pins ETH0_MIIstatus_xlconcat_0/In2]
connect_bd_net -net mb_debug_sys_rst_1 [get_bd_pins mb_debug_sys_rst_in] [get_bd_pins ETH0_LEDs_proc_sys_reset_0/mb_debug_sys_rst]
connect_bd_net [get_bd_pins ETH0_txd_CDC_c_shift_ram_0/Q] [get_bd_pins ETH0_mii_txd_vio_out]
connect_bd_net [get_bd_pins ETH0_rxd_CDC_c_shift_ram_0/Q] [get_bd_pins ETH0_mii_rxd_vio_out]
connect_bd_net [get_bd_pins ETH0_MIIstatus_xlconcat_0/dout] [get_bd_pins ETH0_MIIstatus_CDC_c_shift_ram_0/D]
connect_bd_net [get_bd_pins ETH0_MIIstatus_CDC_c_shift_ram_0/Q] [get_bd_pins ETH0_MIIstatus_vio_out]
connect_bd_net -net s_axi_aresetn_1 [get_bd_pins s_axi_aresetn_in] [get_bd_pins ETH0_axi_ethernetlite_0/s_axi_aresetn]
connect_bd_net -net s_axi_aclk_1 [get_bd_pins s_axi_aclk_in] [get_bd_pins ETH0_LEDs/s_axi_aclk] [get_bd_pins ETH0_axi_ethernetlite_0/s_axi_aclk]
connect_bd_net [get_bd_pins ETH0_axi_ethernetlite_0/ip2intc_irpt] [get_bd_pins ip2intc_irpt_out]
connect_bd_net [get_bd_pins ETH0_axi_ethernetlite_0/phy_rst_n] [get_bd_pins phy_rst_n_out] [get_bd_pins ETH0_LEDs_xlconcat_0/In3]

current_bd_instance /ETH0/ETH0_LEDs
connect_bd_net [get_bd_pins ETH0_LINK_LED_inv] [get_bd_pins ETH0_DA_G]
connect_bd_net [get_bd_pins ETH0_LEDs_xlconcat_0/dout] [get_bd_pins ETH0_LEDs_util_reduced_logic_0/Op1]
connect_bd_net [get_bd_pins s_mii_crs] [get_bd_pins ETH0_LEDs_xlconcat_0/In0]
connect_bd_net [get_bd_pins m_mii_tx_en] [get_bd_pins ETH0_LEDs_xlconcat_0/In1]
connect_bd_net [get_bd_pins ETH0_LEDs_util_reduced_logic_0/Res] [get_bd_pins ETH0_LEDs_c_counter_binary_0/SCLR]
connect_bd_net [get_bd_pins s_axi_aclk] [get_bd_pins ETH0_LEDs_c_counter_binary_0/CLK]
connect_bd_net [get_bd_pins ETH0_LEDs_c_counter_binary_0/THRESH0] [get_bd_pins ETH0_LEDs_util_vector_logic_0/Op1]
connect_bd_net [get_bd_pins ETH0_LEDs_util_vector_logic_0/Res] [get_bd_pins ETH0_DA_Y] [get_bd_pins ETH0_LEDs_c_counter_binary_0/CE]

current_bd_instance /INT_ctrl
connect_bd_intf_net [get_bd_intf_pins s_axi] [get_bd_intf_pins microblaze_0_axi_intc/s_axi]
connect_bd_intf_net [get_bd_intf_pins interrupt] [get_bd_intf_pins microblaze_0_axi_intc/interrupt]
connect_bd_net [get_bd_pins processor_clk] [get_bd_pins microblaze_0_axi_intc/s_axi_aclk] [get_bd_pins microblaze_0_axi_intc/processor_clk]
connect_bd_net [get_bd_pins s_axi_aresetn] [get_bd_pins microblaze_0_axi_intc/s_axi_aresetn]
connect_bd_net [get_bd_pins xlconcat_0/dout] [get_bd_pins microblaze_0_axi_intc/intr]
connect_bd_net -net In0_1 [get_bd_pins In0] [get_bd_pins xlconcat_0/In0]
connect_bd_net -net In1_1 [get_bd_pins In1] [get_bd_pins xlconcat_0/In1]
connect_bd_net -net In2_1 [get_bd_pins In2] [get_bd_pins xlconcat_0/In2]
connect_bd_net -net In3_1 [get_bd_pins In3] [get_bd_pins xlconcat_0/In3]
connect_bd_net -net In4_1 [get_bd_pins In4] [get_bd_pins xlconcat_0/In4]
connect_bd_net -net In5_1 [get_bd_pins In5] [get_bd_pins xlconcat_0/In5]
connect_bd_net -net In6_1 [get_bd_pins In6] [get_bd_pins xlconcat_0/In6]
connect_bd_net -net In7_1 [get_bd_pins In7] [get_bd_pins xlconcat_0/In7]
connect_bd_net -net In8_1 [get_bd_pins In8] [get_bd_pins xlconcat_0/In8]
connect_bd_net -net In9_1 [get_bd_pins In9] [get_bd_pins xlconcat_0/In9]
connect_bd_net -net In10_1 [get_bd_pins In10] [get_bd_pins xlconcat_0/In10]
connect_bd_net -net In11_1 [get_bd_pins In11] [get_bd_pins xlconcat_0/In11]
connect_bd_net [get_bd_pins processor_rst] [get_bd_pins microblaze_0_axi_intc/processor_rst]

current_bd_instance /EUI48
connect_bd_intf_net [get_bd_intf_pins S_AXI] [get_bd_intf_pins axi_EUI48_gpio_0/S_AXI]
connect_bd_net -net microblaze_0_Clk_100MHz [get_bd_pins microblaze_0_Clk_100MHz_o] [get_bd_pins axi_EUI48_gpio_0/s_axi_aclk]
connect_bd_net [get_bd_pins s_axi_aresetn] [get_bd_pins axi_EUI48_gpio_0/s_axi_aresetn]
connect_bd_net -net EUI48_xlslice_1_Dout [get_bd_pins EUI48_xlslice_31to0_0/Dout] [get_bd_pins axi_EUI48_gpio_0/gpio2_io_i]
connect_bd_net [get_bd_pins EUI48_xlconcat_0/dout] [get_bd_pins axi_EUI48_gpio_0/gpio_io_i]
connect_bd_net -net EUI48_xlslice_0_Dout [get_bd_pins EUI48_xlslice_47to32_0/Dout] [get_bd_pins EUI48_xlconcat_0/In0]
connect_bd_net -net EUI48_xlconstant_0_len16_dout [get_bd_pins EUI48_xlconstant_len14_val0/dout] [get_bd_pins EUI48_xlconcat_0/In1]
connect_bd_net [get_bd_pins axi_EUI48_gpio_0/gpio_io_o] [get_bd_pins EUI48_xlslice_31to31_0/Din]
connect_bd_net [get_bd_pins EUI48_xlslice_31to31_0/Dout] [get_bd_pins EUI48_FSM_start]
connect_bd_net [get_bd_pins EUI48_xlconstant_len1_val0/dout] [get_bd_pins EUI48_xlconcat_0/In3]
connect_bd_net [get_bd_pins EUI48_FSM_run] [get_bd_pins EUI48_xlconcat_0/In2]
connect_bd_net [get_bd_pins EUI48_data] [get_bd_pins EUI48_xlslice_47to32_0/Din] [get_bd_pins EUI48_xlslice_31to0_0/Din]

current_bd_instance /CLK1B_CW_0
connect_bd_intf_net [get_bd_intf_pins s_axi_lite] [get_bd_intf_pins CLK1B_clk_wiz_0/s_axi_lite]
connect_bd_intf_net [get_bd_intf_pins S_AXI] [get_bd_intf_pins CLK1B_axi_gpio_0/S_AXI]
connect_bd_net -net CLK1B_50MHz_phy_clk_0 [get_bd_pins CLK1B_clk] [get_bd_pins CLK1B_clk_wiz_0/clk_in1]
connect_bd_net [get_bd_pins CLK1B_clk_wiz_0/clk_out1_RMII] [get_bd_pins clk_out1_RMII]
connect_bd_net [get_bd_pins CLK1B_clk_wiz_0/clk_out2_fMeter] [get_bd_pins clk_out2_fMeter]
connect_bd_net -net dcm_locked_1 [get_bd_pins CLK1B_clk_wiz_0/locked] [get_bd_pins locked]
connect_bd_net [get_bd_pins s_axi_aresetn] [get_bd_pins CLK1B_axi_gpio_0/s_axi_aresetn] [get_bd_pins CLK1B_clk_wiz_0/s_axi_aresetn]
connect_bd_net [get_bd_pins s_axi_aclk] \
  [get_bd_pins CLK1B_c_shift_ram_0/CLK] [get_bd_pins CLK1B_axi_gpio_0/s_axi_aclk] [get_bd_pins CLK1B_clk_wiz_0/s_axi_aclk] \
  [get_bd_pins CLK1B_clk_wiz_0/psclk]
connect_bd_net [get_bd_pins CLK1B_c_shift_ram_0/Q] [get_bd_pins CLK1B_util_vector_logic_0/Op1]
connect_bd_net [get_bd_pins CLK1B_axi_gpio_0/gpio_io_o] [get_bd_pins CLK1B_xlslice_0to0/Din] [get_bd_pins CLK1B_xlslice_1to1/Din]
connect_bd_net [get_bd_pins CLK1B_xlslice_0to0/Dout] [get_bd_pins CLK1B_c_shift_ram_0/D] [get_bd_pins CLK1B_xlconcat_0/In0]
connect_bd_net [get_bd_pins CLK1B_xlconcat_0/dout] [get_bd_pins CLK1B_util_reduced_logic_1/Op1]
connect_bd_net [get_bd_pins CLK1B_util_vector_logic_0/Res] [get_bd_pins CLK1B_xlconcat_0/In1]
connect_bd_net [get_bd_pins CLK1B_clk_wiz_0/clk_out3_Scope] [get_bd_pins clk_out3_Scope]
connect_bd_net [get_bd_pins CLK1B_clk_wiz_0/clk_out4_000deg] [get_bd_pins clk_out4_000deg]
connect_bd_net [get_bd_pins CLK1B_util_reduced_logic_1/Res] [get_bd_pins CLK1B_clk_wiz_0/psen]
connect_bd_net [get_bd_pins CLK1B_xlslice_1to1/Dout] [get_bd_pins CLK1B_clk_wiz_0/psincdec]
connect_bd_net [get_bd_pins CLK1B_clk_wiz_0/psdone] [get_bd_pins psdone] [get_bd_pins CLK1B_axi_gpio_0/gpio2_io_i]

current_bd_instance /SCOPE
connect_bd_intf_net [get_bd_intf_pins S_AXI] [get_bd_intf_pins SCOPE_axi_gpio_0/S_AXI]
connect_bd_intf_net [get_bd_intf_pins S_AXI1] [get_bd_intf_pins SCOPE_axi_gpio_1/S_AXI]
connect_bd_net -net microblaze_0_Clk_100MHz_0 [get_bd_pins s_axi_aclk] \
  [get_bd_pins SCOPE_Timebase_c_counter_binary_0/CLK] [get_bd_pins SCOPE_Signals_CDC_c_shift_ram_0/CLK] \
  [get_bd_pins SCOPE_fifo_generator_0/wr_clk] [get_bd_pins SCOPE_fifo_generator_0/rd_clk] \
  [get_bd_pins SCOPE_Signals_CDC_c_shift_ram_1/CLK] [get_bd_pins SCOPE_Signals_CDC_c_shift_ram_2/CLK] \
  [get_bd_pins SCOPE_Signals_CDC_c_shift_ram_7/CLK] [get_bd_pins SCOPE_Signals_CDC_c_shift_ram_8/CLK] \
  [get_bd_pins SCOPE_Signals_CDC_c_shift_ram_9/CLK] [get_bd_pins SCOPE_Signals_CDC_c_shift_ram_10/CLK] \
  [get_bd_pins SCOPE_Signals_CDC_c_shift_ram_11/CLK] [get_bd_pins SCOPE_Signals_CDC_c_shift_ram_12/CLK] \
  [get_bd_pins SCOPE_Signals_CDC_c_shift_ram_13/CLK] [get_bd_pins SCOPE_Signals_CDC_c_shift_ram_14/CLK] \
  [get_bd_pins SCOPE_Signals_CDC_c_shift_ram_15/CLK] [get_bd_pins SCOPE_Signals_CDC_c_shift_ram_16/CLK] \
  [get_bd_pins SCOPE_axi_gpio_0/s_axi_aclk] [get_bd_pins SCOPE_axi_gpio_1/s_axi_aclk]
connect_bd_net -net rst_mig_7series_0_100M_peripheral_aresetn_0 [get_bd_pins s_axi_aresetn] \
  [get_bd_pins SCOPE_axi_gpio_0/s_axi_aresetn] [get_bd_pins SCOPE_axi_gpio_1/s_axi_aresetn]
connect_bd_net [get_bd_pins SCOPE_Signals_xlconcat_1/dout] [get_bd_pins SCOPE_FSM_TrigSrc] [get_bd_pins SCOPE_Signals_xlconcat_0/In0]
connect_bd_net [get_bd_pins CLK1B_CW_0_clk_out3_Scope_RefClk] [get_bd_pins SCOPE_Signals_CDC_c_shift_ram_0/D]
connect_bd_net [get_bd_pins ETH0_s_mii_col] [get_bd_pins SCOPE_Signals_CDC_c_shift_ram_7/D]
connect_bd_net [get_bd_pins ETH0_s_mii_crs] [get_bd_pins SCOPE_Signals_CDC_c_shift_ram_8/D]
connect_bd_net [get_bd_pins ETH0_s_mii_rx_dv] [get_bd_pins SCOPE_Signals_CDC_c_shift_ram_9/D]
connect_bd_net [get_bd_pins ETH0_s_mii_rxd] [get_bd_pins SCOPE_Signals_CDC_c_shift_ram_10/D]
connect_bd_net [get_bd_pins ETH0_s_mii_rx_er] [get_bd_pins SCOPE_Signals_CDC_c_shift_ram_11/D]
connect_bd_net [get_bd_pins ETH0_s_mii_rx_clk] [get_bd_pins SCOPE_Signals_CDC_c_shift_ram_12/D]
connect_bd_net [get_bd_pins ETH0_m_mii_tx_en] [get_bd_pins SCOPE_Signals_CDC_c_shift_ram_13/D]
connect_bd_net [get_bd_pins ETH0_m_mii_txd] [get_bd_pins SCOPE_Signals_CDC_c_shift_ram_14/D]
connect_bd_net [get_bd_pins ETH0_m_mii_tx_er] [get_bd_pins SCOPE_Signals_CDC_c_shift_ram_15/D]
connect_bd_net [get_bd_pins ETH0_s_mii_tx_clk] [get_bd_pins SCOPE_Signals_CDC_c_shift_ram_16/D]
connect_bd_net [get_bd_pins SCOPE_Signals_xlconcat_0/dout] [get_bd_pins SCOPE_fifo_generator_0/din]
connect_bd_net [get_bd_pins SCOPE_FSM_Timebase_CE] [get_bd_pins SCOPE_Timebase_c_counter_binary_0/CE]
connect_bd_net [get_bd_pins SCOPE_FSM_FIFO_RdEn] [get_bd_pins SCOPE_fifo_generator_0/rd_en]
connect_bd_net [get_bd_pins SCOPE_fifo_generator_0/valid] [get_bd_pins SCOPE_FSM_FIFO_RdValid]
connect_bd_net [get_bd_pins SCOPE_fifo_generator_0/empty] [get_bd_pins SCOPE_FSM_FIFO_RdEmpty]
connect_bd_net [get_bd_pins SCOPE_FSM_FIFO_WrEn] [get_bd_pins SCOPE_fifo_generator_0/wr_en]
connect_bd_net [get_bd_pins SCOPE_GPIO3_Out_xlslice_63downto32/Dout] [get_bd_pins SCOPE_axi_gpio_1/gpio_io_i]
connect_bd_net [get_bd_pins SCOPE_GPIO4_Out_xlslice_31downto0/Dout] [get_bd_pins SCOPE_axi_gpio_1/gpio2_io_i]
connect_bd_net [get_bd_pins SCOPE_fifo_generator_0/dout] \
  [get_bd_pins SCOPE_GPIO4_Out_xlslice_31downto0/Din] [get_bd_pins SCOPE_GPIO3_Out_xlslice_63downto32/Din]
connect_bd_net [get_bd_pins SCOPE_fifo_generator_0/wr_rst_busy] [get_bd_pins SCOPE_FSM_FIFO_wr_rst_busy]
connect_bd_net [get_bd_pins SCOPE_fifo_generator_0/rd_rst_busy] [get_bd_pins SCOPE_FSM_FIFO_rd_rst_busy]
connect_bd_net [get_bd_pins SCOPE_fifo_generator_0/almost_full] [get_bd_pins SCOPE_FSM_FIFO_WrFull]
connect_bd_net [get_bd_pins SCOPE_Timebase_c_counter_binary_0/Q] [get_bd_pins SCOPE_Signals_xlconcat_0/In1]
connect_bd_net [get_bd_pins SCOPE_FSM_FIFO_Rst] [get_bd_pins SCOPE_fifo_generator_0/rst]
connect_bd_net [get_bd_pins SCOPE_axi_gpio_0/gpio_io_o] [get_bd_pins SCOPE_FSM_GPIO0_Out]
connect_bd_net [get_bd_pins SCOPE_FSM_GPIO1_In] [get_bd_pins SCOPE_axi_gpio_0/gpio2_io_i]
connect_bd_net [get_bd_pins Dbg_RMII_PHY_M_0_crs_dv] [get_bd_pins SCOPE_Signals_CDC_c_shift_ram_1/D]
connect_bd_net [get_bd_pins Dbg_RMII_PHY_M_0_rxd] [get_bd_pins SCOPE_Signals_CDC_c_shift_ram_2/D]
connect_bd_net [get_bd_pins SCOPE_Signals_CDC_c_shift_ram_0/Q] [get_bd_pins SCOPE_Signals_xlconcat_1/In0]
connect_bd_net [get_bd_pins SCOPE_Signals_CDC_c_shift_ram_7/Q] [get_bd_pins SCOPE_Signals_xlconcat_1/In7]
connect_bd_net [get_bd_pins SCOPE_Signals_CDC_c_shift_ram_8/Q] [get_bd_pins SCOPE_Signals_xlconcat_1/In8]
connect_bd_net [get_bd_pins SCOPE_Signals_CDC_c_shift_ram_9/Q] [get_bd_pins SCOPE_Signals_xlconcat_1/In9]
connect_bd_net [get_bd_pins SCOPE_Signals_CDC_c_shift_ram_10/Q] [get_bd_pins SCOPE_Signals_xlconcat_1/In10]
connect_bd_net [get_bd_pins SCOPE_Signals_CDC_c_shift_ram_11/Q] [get_bd_pins SCOPE_Signals_xlconcat_1/In11]
connect_bd_net [get_bd_pins SCOPE_Signals_CDC_c_shift_ram_12/Q] [get_bd_pins SCOPE_Signals_xlconcat_1/In12]
connect_bd_net [get_bd_pins SCOPE_Signals_CDC_c_shift_ram_13/Q] [get_bd_pins SCOPE_Signals_xlconcat_1/In13]
connect_bd_net [get_bd_pins SCOPE_Signals_CDC_c_shift_ram_14/Q] [get_bd_pins SCOPE_Signals_xlconcat_1/In14]
connect_bd_net [get_bd_pins SCOPE_Signals_CDC_c_shift_ram_15/Q] [get_bd_pins SCOPE_Signals_xlconcat_1/In15]
connect_bd_net [get_bd_pins SCOPE_Signals_CDC_c_shift_ram_16/Q] [get_bd_pins SCOPE_Signals_xlconcat_1/In16]
connect_bd_net [get_bd_pins SCOPE_Signals_CDC_c_shift_ram_1/Q] [get_bd_pins SCOPE_Signals_xlconcat_1/In1]
connect_bd_net [get_bd_pins SCOPE_Signals_CDC_c_shift_ram_2/Q] [get_bd_pins SCOPE_Signals_xlconcat_1/In2]
connect_bd_net [get_bd_pins SCLR] [get_bd_pins SCOPE_Timebase_c_counter_binary_0/SCLR]

current_bd_instance /CFG_Si5338
connect_bd_intf_net [get_bd_intf_pins CFG_microblaze_0/M_AXI_DP] [get_bd_intf_pins CFG_Si5338_axi_periph_interconnect_0/S00_AXI]
connect_bd_intf_net [get_bd_intf_pins SC0712_0/EMIO_I2C] [get_bd_intf_pins CFG_Si5338_axi_iic_0/IIC]
connect_bd_intf_net [get_bd_intf_pins CFG_Si5338_axi_periph_interconnect_0/M02_AXI] [get_bd_intf_pins CFG_Si5338_axi_quad_spi_0/AXI_LITE]
connect_bd_intf_net [get_bd_intf_pins CFG_Si5338_axi_periph_interconnect_0/M03_AXI] [get_bd_intf_pins CFG_Si5338_DBG_axi_gpio_0/S_AXI]
connect_bd_intf_net [get_bd_intf_pins CFG_Si5338_axi_iic_0/S_AXI] [get_bd_intf_pins CFG_Si5338_axi_periph_interconnect_0/M01_AXI]
connect_bd_intf_net [get_bd_intf_pins DEBUG] [get_bd_intf_pins CFG_microblaze_0/DEBUG]
connect_bd_intf_net [get_bd_intf_pins CFG_microblaze_0/DLMB] [get_bd_intf_pins CFG_Local_BRAM/DLMB_M]
connect_bd_intf_net [get_bd_intf_pins S01_AXI] [get_bd_intf_pins CFG_Si5338_axi_periph_interconnect_0/S01_AXI]
connect_bd_intf_net [get_bd_intf_pins S02_AXI] [get_bd_intf_pins CFG_Si5338_axi_periph_interconnect_0/S02_AXI]
connect_bd_intf_net [get_bd_intf_pins CFG_Si5338_axi_periph_interconnect_0/M00_AXI] [get_bd_intf_pins CFG_Si5338_axi_gpio_0/S_AXI]
connect_bd_intf_net [get_bd_intf_pins mdm_USER2_0_BOOT_LMB_0_in] [get_bd_intf_pins CFG_Local_BRAM/mdm_USER2_0_BOOT_LMB_0_in]
connect_bd_intf_net [get_bd_intf_pins CFG_microblaze_0/ILMB] [get_bd_intf_pins CFG_Local_BRAM/ILMB_M]
connect_bd_intf_net [get_bd_intf_pins qspi_flash] [get_bd_intf_pins CFG_Si5338_axi_quad_spi_0/SPI_0]
connect_bd_net [get_bd_pins SC0712_0/mon_GPIO1_I] [get_bd_pins mon_GPIO1_I]
connect_bd_net [get_bd_pins SC0712_0/mon_GPIO1_O] [get_bd_pins mon_GPIO1_O]
connect_bd_net [get_bd_pins SC0712_0/ext_scl_o] [get_bd_pins PLL_I2C_ext_scl_o]
connect_bd_net [get_bd_pins PLL_I2C_ext_sda] [get_bd_pins SC0712_0/ext_sda]
connect_bd_net [get_bd_pins SC0712_0/reset_out] [get_bd_pins reset_out]
connect_bd_net [get_bd_pins ext_reset] [get_bd_pins rst_proc_CFG_Si5338_0_65M/ext_reset_in] [get_bd_pins rst_dbg_CFG_Si5338_0_65M_1/ext_reset_in]
connect_bd_net -net CFG_Si5338_clk_wiz_0_65MHz_0 [get_bd_pins CFG_Si5338_clk_wiz_0/clk_out1_65MHz] \
  [get_bd_pins SC0712_0/mcs_clk_in] [get_bd_pins rst_proc_CFG_Si5338_0_65M/slowest_sync_clk] \
  [get_bd_pins CFG_Local_BRAM/LMB_Clk] [get_bd_pins CFG_Si5338_clk_wiz_0_65MHz_out] \
  [get_bd_pins rst_dbg_CFG_Si5338_0_65M_1/slowest_sync_clk] [get_bd_pins CFG_Si5338_DBG_axi_gpio_0/s_axi_aclk] \
  [get_bd_pins CFG_Si5338_axi_gpio_0/s_axi_aclk] [get_bd_pins CFG_Si5338_axi_iic_0/s_axi_aclk] \
  [get_bd_pins CFG_Si5338_axi_periph_interconnect_0/ACLK] [get_bd_pins CFG_Si5338_axi_periph_interconnect_0/S00_ACLK] \
  [get_bd_pins CFG_Si5338_axi_periph_interconnect_0/M00_ACLK] [get_bd_pins CFG_Si5338_axi_periph_interconnect_0/M01_ACLK] \
  [get_bd_pins CFG_Si5338_axi_periph_interconnect_0/S01_ACLK] [get_bd_pins CFG_Si5338_axi_periph_interconnect_0/S02_ACLK] \
  [get_bd_pins CFG_Si5338_axi_periph_interconnect_0/M02_ACLK] [get_bd_pins CFG_Si5338_axi_periph_interconnect_0/M03_ACLK] \
  [get_bd_pins CFG_Si5338_axi_quad_spi_0/s_axi_aclk] [get_bd_pins CFG_microblaze_0/Clk]
connect_bd_net -net CFG_Si5338_proc_sys_reset_0_interconnect_aresetn [get_bd_pins rst_proc_CFG_Si5338_0_65M/interconnect_aresetn] \
  [get_bd_pins CFG_Si5338_interconnect_aresetn] [get_bd_pins CFG_Si5338_axi_periph_interconnect_0/ARESETN]
connect_bd_net [get_bd_pins mb_debug_sys_rst] [get_bd_pins rst_proc_CFG_Si5338_0_65M/mb_debug_sys_rst]
connect_bd_net -net CFG_Si5338_proc_sys_reset_0_peripheral_aresetn [get_bd_pins rst_proc_CFG_Si5338_0_65M/peripheral_aresetn] \
  [get_bd_pins CFG_Si5338_peripheral_aresetn] [get_bd_pins CFG_Si5338_DBG_axi_gpio_0/s_axi_aresetn] \
  [get_bd_pins CFG_Si5338_axi_gpio_0/s_axi_aresetn] [get_bd_pins CFG_Si5338_axi_iic_0/s_axi_aresetn] \
  [get_bd_pins CFG_Si5338_axi_periph_interconnect_0/S00_ARESETN] \
  [get_bd_pins CFG_Si5338_axi_periph_interconnect_0/M00_ARESETN] \
  [get_bd_pins CFG_Si5338_axi_periph_interconnect_0/M01_ARESETN] \
  [get_bd_pins CFG_Si5338_axi_periph_interconnect_0/S01_ARESETN] \
  [get_bd_pins CFG_Si5338_axi_periph_interconnect_0/S02_ARESETN] \
  [get_bd_pins CFG_Si5338_axi_periph_interconnect_0/M02_ARESETN] \
  [get_bd_pins CFG_Si5338_axi_periph_interconnect_0/M03_ARESETN] [get_bd_pins CFG_Si5338_axi_quad_spi_0/s_axi_aresetn]
connect_bd_net -net rst_CFG_0_50M_mb_reset [get_bd_pins rst_proc_CFG_Si5338_0_65M/mb_reset] [get_bd_pins CFG_microblaze_0/Reset]
connect_bd_net -net rst_CFG_0_50M_bus_struct_reset [get_bd_pins rst_proc_CFG_Si5338_0_65M/bus_struct_reset] [get_bd_pins CFG_Local_BRAM/SYS_Rst]
connect_bd_net -net BOOT_PLL_axi_gpio_0_gpio_io_o [get_bd_pins CFG_Si5338_axi_gpio_0/gpio_io_o] [get_bd_pins SC0712_0/GPIO1_O]
connect_bd_net [get_bd_pins SC0712_0/GPIO1_I] [get_bd_pins CFG_Si5338_axi_gpio_0/gpio2_io_i]
connect_bd_net -net CFG_axi_quad_spi_0_cfgmclk [get_bd_pins CFG_Si5338_axi_quad_spi_0/cfgmclk] [get_bd_pins CFG_Si5338_clk_wiz_0/clk_in1]
connect_bd_net -net CFG_Si5338_axi_quad_spi_0_ip2intc_65MHz_irpt [get_bd_pins CFG_Si5338_axi_quad_spi_0/ip2intc_irpt] \
  [get_bd_pins CFG_Si5338_qspi_ip2intc_irpt]
connect_bd_net -net CFG_axi_quad_spi_0_eos [get_bd_pins CFG_Si5338_axi_quad_spi_0/eos] \
  [get_bd_pins rst_proc_CFG_Si5338_0_65M/aux_reset_in] [get_bd_pins rst_dbg_CFG_Si5338_0_65M_1/aux_reset_in]
connect_bd_net [get_bd_pins CFG_Si5338_clk_wiz_0/locked] \
  [get_bd_pins rst_proc_CFG_Si5338_0_65M/dcm_locked] [get_bd_pins rst_dbg_CFG_Si5338_0_65M_1/dcm_locked]
connect_bd_net [get_bd_pins rst_dbg_CFG_Si5338_0_65M_1/interconnect_aresetn] [get_bd_pins interconnect_aresetn]
connect_bd_net [get_bd_pins CFG_Si5338_clk_wiz_0/clk_out2_32MHz5] [get_bd_pins CFG_Si5338_axi_quad_spi_0/ext_spi_clk]
connect_bd_net [get_bd_pins CFG_Si5338_DBG_axi_gpio_0/gpio_io_o] [get_bd_pins gpio_io_o]
connect_bd_net [get_bd_pins CFG_Si5338_DBG_axi_gpio_0/gpio2_io_o] [get_bd_pins gpio2_io_o]
set_property HDL_ATTRIBUTE.BMM_INFO_PROCESSOR {microblaze-le > msys CFG_Si5338/CFG_Local_BRAM/dlmb_bram_if_cntlr_0} [get_bd_cells CFG_microblaze_0]
set_property HDL_ATTRIBUTE.KEEP_HIERARCHY yes [get_bd_cells CFG_microblaze_0]

current_bd_instance /CFG_Si5338/CFG_Local_BRAM
connect_bd_intf_net [get_bd_intf_pins ILMB_M] [get_bd_intf_pins ilmb_v10_1/LMB_M]
connect_bd_intf_net [get_bd_intf_pins DLMB_M] [get_bd_intf_pins dlmb_v10_0/LMB_M]
connect_bd_intf_net [get_bd_intf_pins dlmb_bram_if_cntlr_0/BRAM_PORT] [get_bd_intf_pins blk_mem_gen_0/BRAM_PORTB]
connect_bd_intf_net [get_bd_intf_pins dlmb_v10_0/LMB_Sl_0] [get_bd_intf_pins dlmb_bram_if_cntlr_0/SLMB]
connect_bd_intf_net [get_bd_intf_pins ilmb_v10_1/LMB_Sl_0] [get_bd_intf_pins ilmb_bram_if_cntlr_0/SLMB]
connect_bd_intf_net [get_bd_intf_pins mdm_USER2_0_BOOT_LMB_0_in] [get_bd_intf_pins dlmb_bram_if_cntlr_0/SLMB1]
connect_bd_intf_net [get_bd_intf_pins ilmb_bram_if_cntlr_0/BRAM_PORT] [get_bd_intf_pins blk_mem_gen_0/BRAM_PORTA]
connect_bd_net [get_bd_pins LMB_Clk] \
  [get_bd_pins dlmb_v10_0/LMB_Clk] [get_bd_pins ilmb_v10_1/LMB_Clk] [get_bd_pins ilmb_bram_if_cntlr_0/LMB_Clk] \
  [get_bd_pins dlmb_bram_if_cntlr_0/LMB_Clk]
connect_bd_net [get_bd_pins SYS_Rst] \
  [get_bd_pins dlmb_v10_0/SYS_Rst] [get_bd_pins ilmb_v10_1/SYS_Rst] [get_bd_pins ilmb_bram_if_cntlr_0/LMB_Rst] \
  [get_bd_pins dlmb_bram_if_cntlr_0/LMB_Rst]
set_property HDL_ATTRIBUTE.BMM_INFO_ADDRESS_SPACE {byte  0x00000000 32 > msys CFG_Si5338/CFG_Local_BRAM/blk_mem_gen_0} [get_bd_cells dlmb_bram_if_cntlr_0]
set_property HDL_ATTRIBUTE.KEEP_HIERARCHY yes [get_bd_cells dlmb_bram_if_cntlr_0]
